# EAGLE design MouseGoggles MiniHatAA-1-1 (EAGLE 9.6.2)
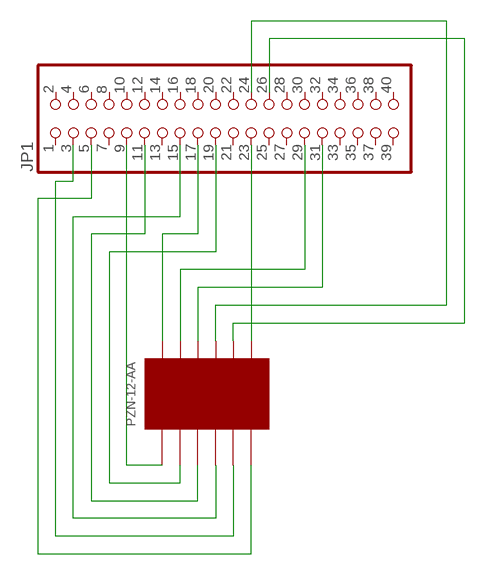
[diagram p0: schematic, sheet 1]

## Parts
JP1  PINHD-2X20-BIG  [2X20-BIG]
U$1  PZN_12_AA  [OMN_PZN_NANO_6X2]

## Nets
N$1: JP1.17 U$1.P$1
N$2: JP1.29 U$1.P$3
N$3: JP1.31 U$1.P$5
N$4: JP1.23 U$1.P$11
N$5: JP1.24 U$1.P$7
N$6: JP1.26 U$1.P$9
N$7: JP1.9 U$1.P$2
N$8: JP1.19 U$1.P$4
N$9: JP1.11 U$1.P$6
N$10: JP1.15 U$1.P$8
N$11: JP1.3 U$1.P$10
N$12: JP1.5 U$1.P$12
Unconnected: JP1.1 JP1.2 JP1.4 JP1.6 JP1.7 JP1.8 JP1.10 JP1.12 JP1.13 JP1.14 JP1.16 JP1.18 JP1.20 JP1.21 JP1.22 JP1.25 JP1.27 JP1.28 JP1.30 JP1.32 JP1.33 JP1.34 JP1.35 JP1.36 JP1.37 JP1.38 JP1.39 JP1.40

## Library data of the parts
JP1 = adafruit:PINHD-2X20: PIN HEADER
U$1 = PZN_12_AA:PZN_12_AA

## Board
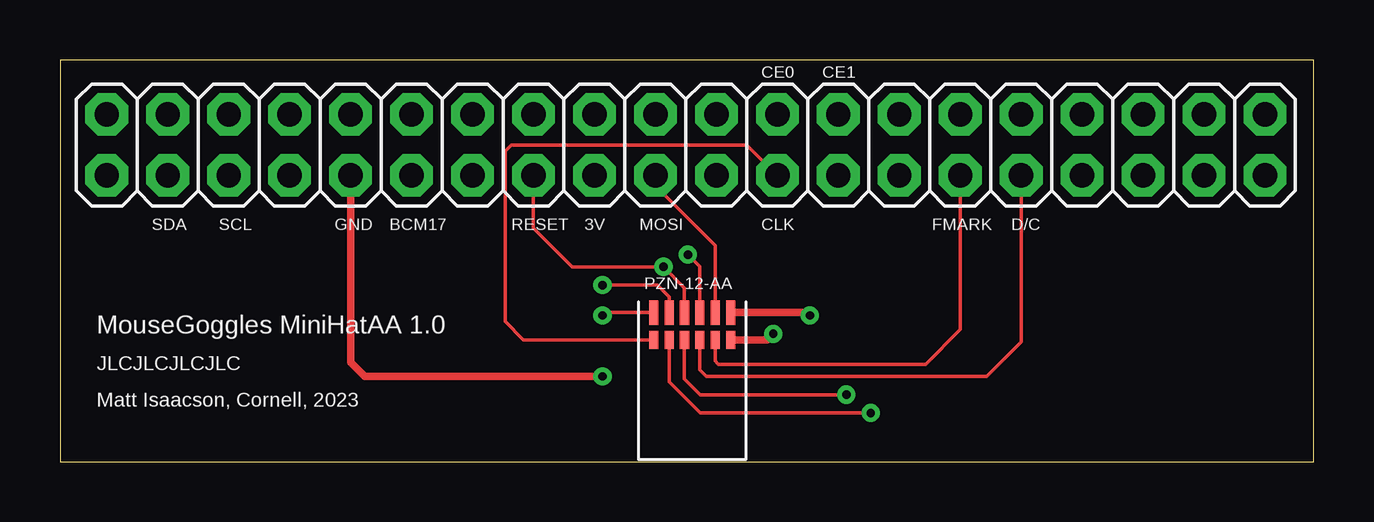
[diagram p1: board, top side]
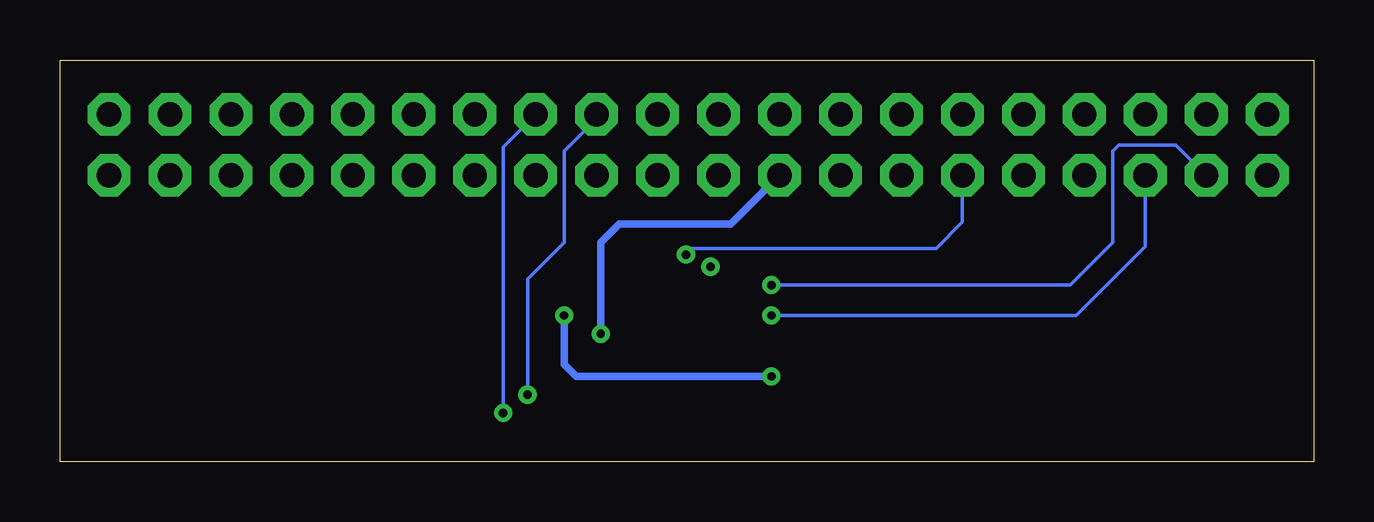
[diagram p2: board, bottom side, seen from below]

Size 52.25 x 16.75 mm. Coordinates in mm from the lower left corner, seen from the top.
Outline: 0,0 52.25,0 52.25,16.75 0,16.75 0,0
Copper layers (1*16): Top 0.035mm / dielectric 1.5mm / Bottom 0.035mm
Design rules "default": minimum track width 6mil, minimum drill 0.35mm, track to track 6mil, track to pad 6mil, pad to pad 6mil, via to via 6mil, smd to smd 6mil, copper to edge 40mil, drill to drill 6mil, minimum pad ring 10mil, minimum via ring 8mil, stop-mask expansion 4mil, vias tented up to drill 0mil, thermal gap 10mil

### Footprints (pad centres in the part's own frame; a part is rotated, then mirrored left to right if it is on the bottom)
2X20-BIG = drill 1.016 pad 1.778 octagon: 1 -24.13,-1.27; 2 -24.13,1.27; 3 -21.59,-1.27; 4 -21.59,1.27; 5 -19.05,-1.27; 6 -19.05,1.27; 7 -16.51,-1.27; 8 -16.51,1.27; 9 -13.97,-1.27; 10 -13.97,1.27; 11 -11.43,-1.27; 12 -11.43,1.27; 13 -8.89,-1.27; 14 -8.89,1.27; 15 -6.35,-1.27; 16 -6.35,1.27; 17 -3.81,-1.27; 18 -3.81,1.27; 19 -1.27,-1.27; 20 -1.27,1.27; 21 1.27,-1.27; 22 1.27,1.27; 23 3.81,-1.27; 24 3.81,1.27; 25 6.35,-1.27; 26 6.35,1.27; 27 8.89,-1.27; 28 8.89,1.27; 29 11.43,-1.27; 30 11.43,1.27; 31 13.97,-1.27; 32 13.97,1.27; 33 16.51,-1.27; 34 16.51,1.27; 35 19.05,-1.27; 36 19.05,1.27; 37 21.59,-1.27; 38 21.59,1.27; 39 24.13,-1.27; 40 24.13,1.27
OMN_PZN_NANO_6X2 = smd 0.76 x 0.38: P$1 0,0; P$3 0,0.64; P$5 0,1.28; P$7 0,1.92; P$9 0,2.56; P$11 0,3.2 | smd 1.02 x 0.38: P$2 1.14,0; P$4 1.14,0.64; P$6 1.14,1.28; P$8 1.14,1.92; P$10 1.14,2.56; P$12 1.14,3.2

### Placement (x,y rotation side)
JP1  26.08,13.21 0 top
U$1  27.94,5.08 90 top

### Tracks (layer width: path | path; a pad name or v marks a point on that pad's centre or on a via)
N$1  (via drill 0.35)
  Top 0.305: U$1.P$1 29.46,5.08 v29.72,5.33
  Bottom 0.305: JP1.17 24.3,9.91 28.96,9.91 29.72,9.14 v29.72,5.33
N$2
  Top 0.152: U$1.P$3 27.3,4.2 27.43,4.06 36.07,4.06 37.51,5.5 JP1.29
N$3
  Top 0.152: JP1.31 40.05,5 38.61,3.56 26.92,3.56 26.66,3.82 U$1.P$5
N$4
  Top 0.152: JP1.23 28.62,13.21 18.8,13.21 18.54,12.95 18.54,5.84 19.3,5.08 U$1.P$11
N$5  (via drill 0.35)
  Top 0.152: U$1.P$7 26.02,3.44 26.67,2.79 v32.77,2.79
  Bottom 0.152: JP1.24 29.89,14.31 31.24,12.95 31.24,9.14 32.77,7.62 v32.77,2.79
N$6  (via drill 0.35)
  Top 0.152: U$1.P$9 25.38,3.32 26.67,2.03 v33.78,2.03
  Bottom 0.152: JP1.26 33.78,13.12 v33.78,2.03
N$7  (via drill 0.35)
  Top 0.305: JP1.9 12.11,4.15 12.7,3.56 v22.61,3.56 | U$1.P$2 31.12,6.22 v31.24,6.1
  Bottom 0.305: v22.61,3.56 30.73,3.56 31.24,4.06 v31.24,6.1
N$8
  Top 0.152: JP1.19 24.81,11.51 27.3,9.02 U$1.P$4
N$9  (via drill 0.35)
  Top 0.152: U$1.P$6 26.66,8.14 v26.16,8.64
  Bottom 0.152: v26.16,8.64 25.91,8.89 15.75,8.89 14.65,9.99 JP1.11
N$10  (via drill 0.35)
  Top 0.152: U$1.P$8 26.02,7.25 v25.15,8.13 21.34,8.13 19.73,9.73 JP1.15
N$11  (via drill 0.35)
  Top 0.152: U$1.P$10 25.38,6.88 24.89,7.37 v22.61,7.37
  Bottom 0.152: JP1.3 5.76,13.21 8.13,13.21 8.38,12.95 8.38,9.14 10.16,7.37 v22.61,7.37
N$12  (via drill 0.35)
  Top 0.152: U$1.P$12 22.61,6.22 v22.61,6.1
  Bottom 0.152: v22.61,6.1 9.91,6.1 7.03,8.97 JP1.5

### Text on the board
tNames: CE0 | CE1 | SDA | SCL | GND | BCM17 | RESET | 3V | MOSI | CLK | FMARK | D/C | MouseGoggles MiniHatAA 1.0 | JLCJLCJLCJLC | Matt Isaacson, Cornell, 2023